# EasyEDA schematic oLoRa-part-power.json
TITLE: oLoRa-part-power; REV: 1.0; Date: 2019-08-19; Sheet: 1/1; Drawn By: 김석현; Company: RMTEC
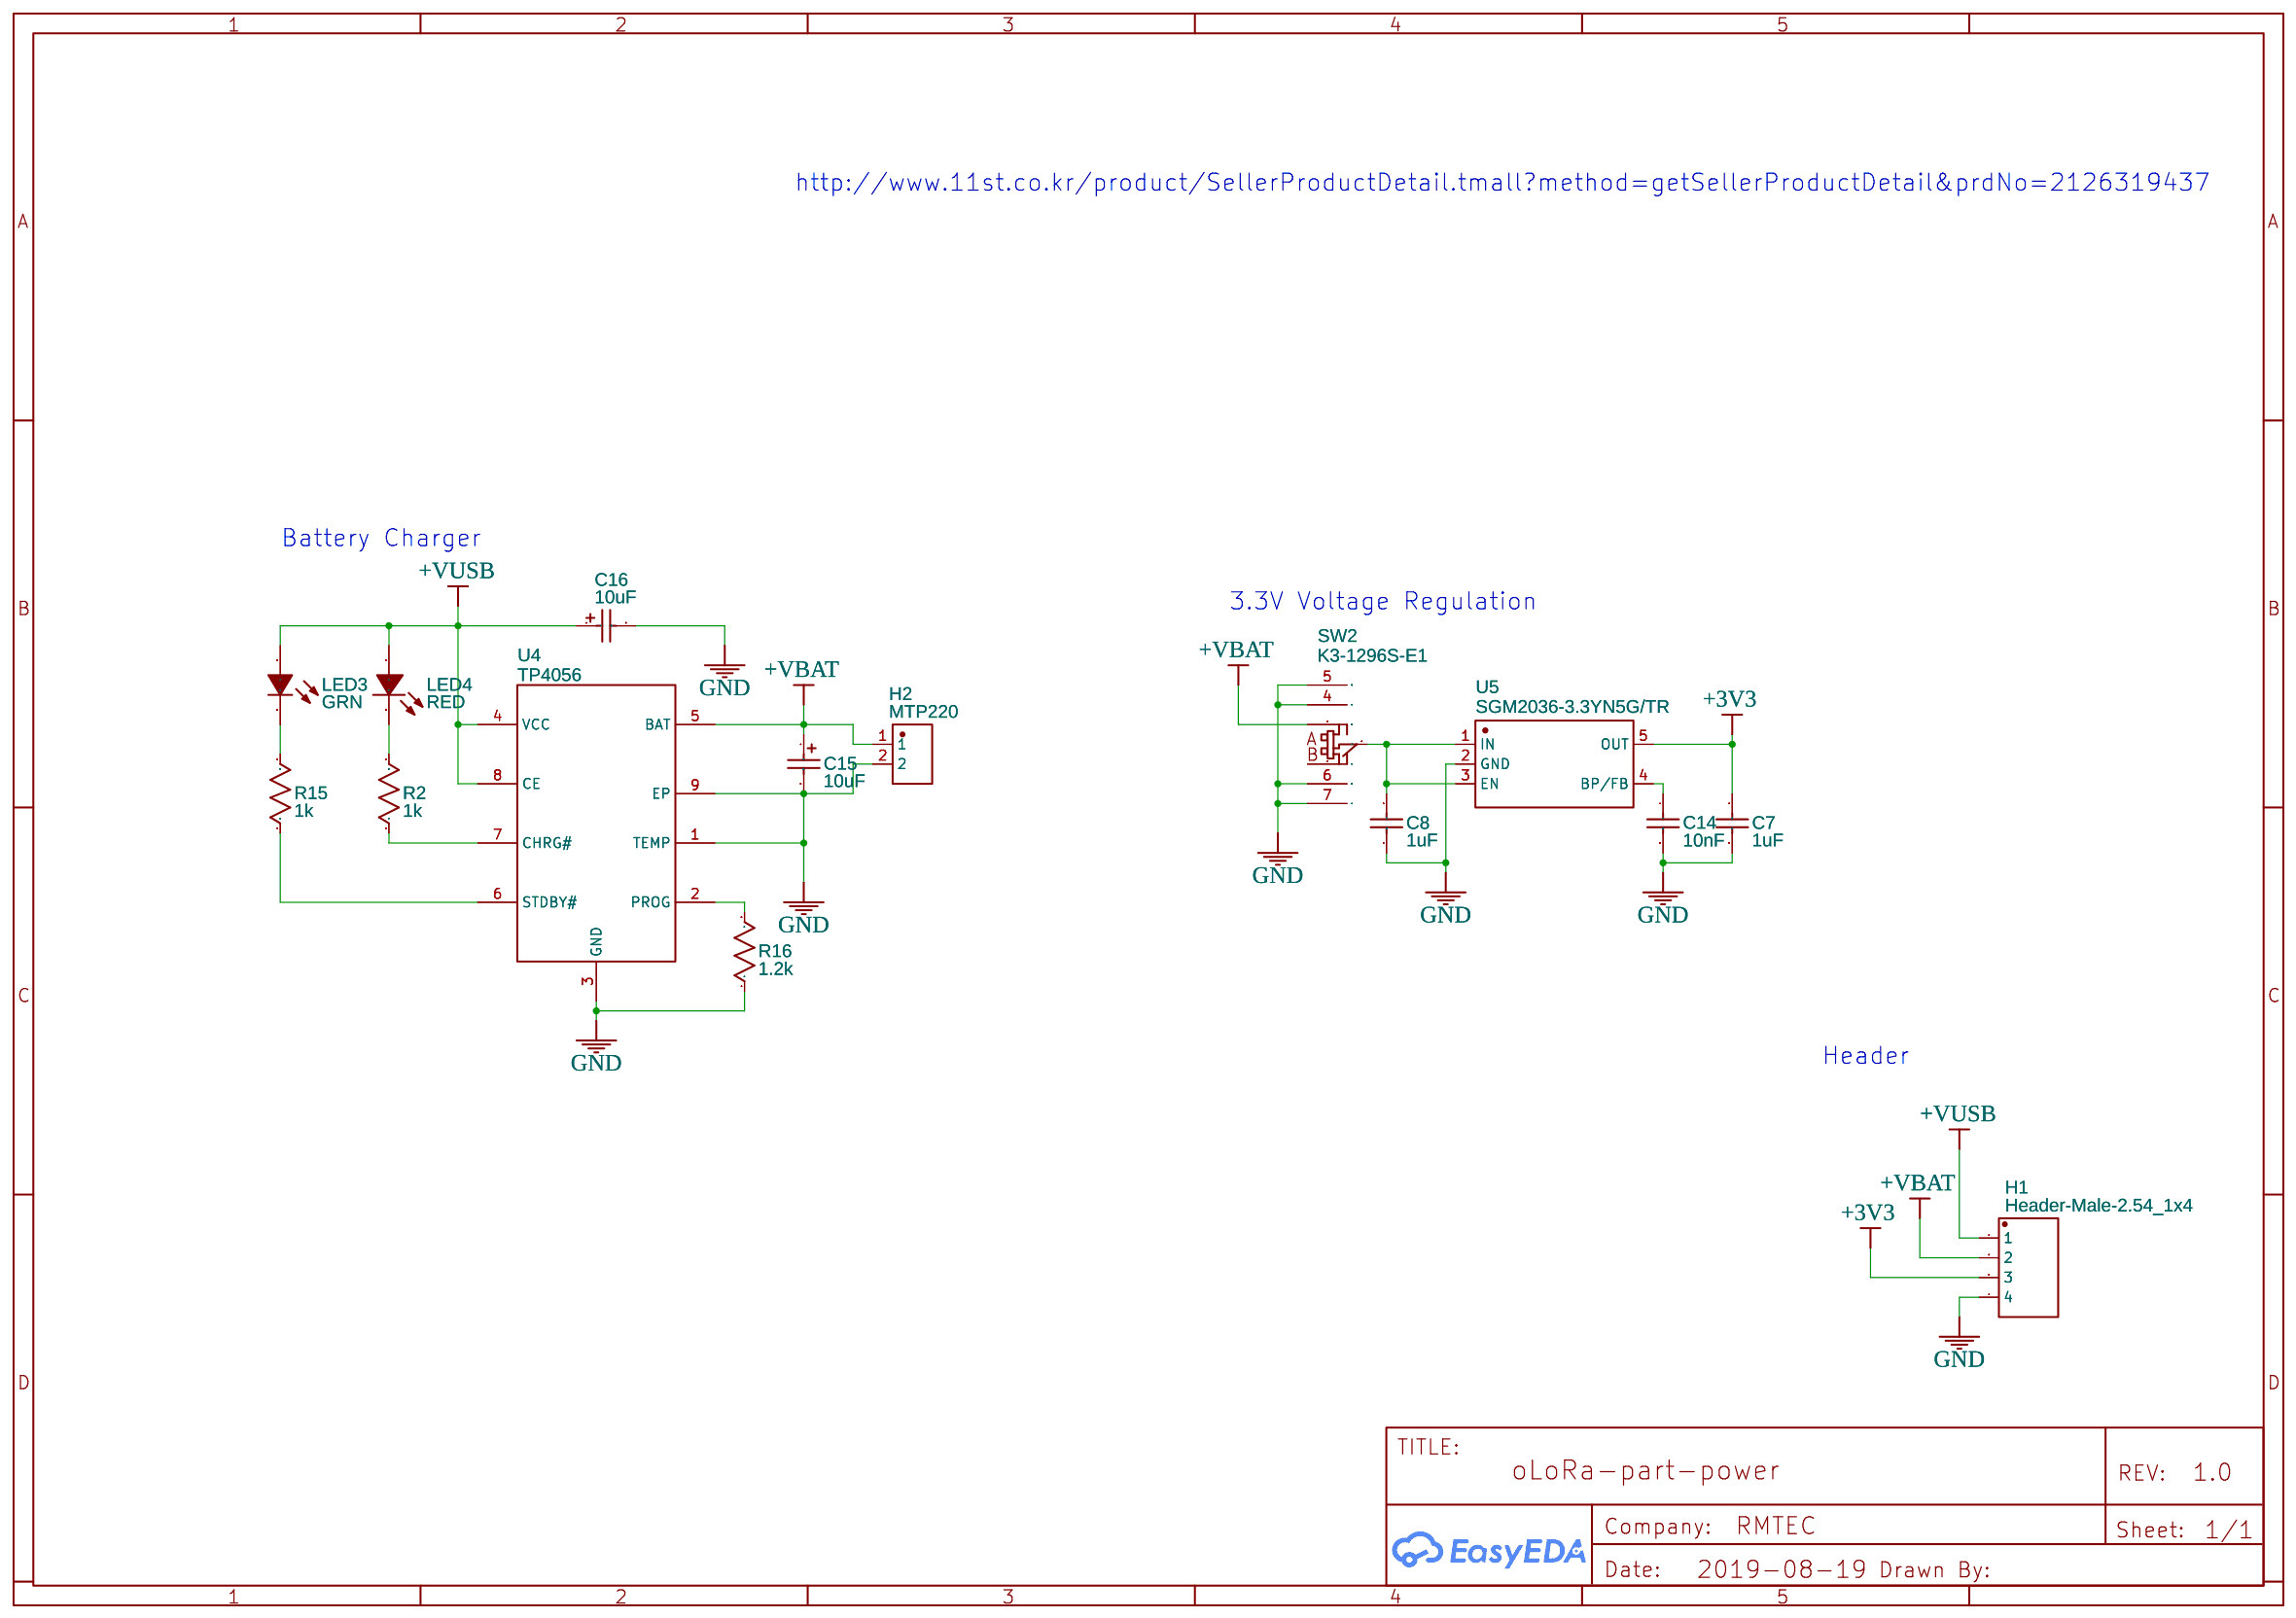
[diagram p0: schematic sheet]

## Parts
C7  1uF  [0603]
C8  1uF  [0603]
C14  10nF  [0603]
C15  10uF  [CAP-CASE-A_3216]
C16  10uF  [CAP-CASE-A_3216]
H1  Header-Male-2.54_1x4  [210S-1X4P]
H2  MTP220  [PH-TH_2PIN-H-MALE-PITCH2.00-L]
LED3  GRN  [LED-0603]
LED4  RED  [LED-0603]
R2  1k  [0603]
R15  1k  [0603]
R16  1.2k  [0603]
SW2  K3-1296S-E1  [K3-1296S-E1]
U4  TP4056  [SOP-8_EP_150MIL]
U5  SGM2036-3.3YN5G/TR  [SOT-23-5]

## Library data of the parts
C7 C8 = CL10B105KQ8NNNC: Supplier: LCSC; Manufacturer: SAMSUNG; Supplier Part: C105524
C14 = CGA3E2C0G1H103JT0Y0N: Supplier: LCSC; Supplier Part: C76710; Manufacturer: TDK; Contributor: LCSC; LCSC Assembly: Yes; SMT Type: Extend
C15 C16 = TAJA106K016RNJ: Supplier: LCSC; Manufacturer: AVX; LCSC Assembly: Yes; Supplier Part: C7171; SMT Type: Basic
H1 = -: Supplier: LCSC; Manufacturer: Ckmtw; Manufacturer Part: 210S-1*4P L=11.6MMGold-plated black; Contributor: LCSC; Supplier Part: C124378
H2 = -: Supplier: LCSC; Supplier Part: C376096; Manufacturer: MINTRON; Manufacturer Part: MTP220-1102R1; Contributor: LCSC
LED3 = -: Supplier: LCSC; Manufacturer: EVERLIGHT; Manufacturer Part: 19-217/GHC-YR1S2/3T; LCSC Assembly: Yes; image: //image.lceda.cn/szlcsc/C72043.jpg; Supplier Part: C72043; SMT Type: Basic
LED4 = -: Supplier: LCSC; Manufacturer: KENTO; Manufacturer Part: KT-0603R; LCSC Assembly: Yes; image: //image.lceda.cn/szlcsc/C2286.jpg; Supplier Part: C2286; SMT Type: Basic
R2 R15 R16 = Res_0603(1/10W)_US
SW2 = -: Supplier: LCSC; Manufacturer: HRO; Contributor: LCSC; Supplier Part: C128955
U4 = -: Contributor: Guest; Supplier: LCSC; Manufacturer: TOPPOWER; LCSC Assembly: Yes; image: //image.lceda.cn/szlcsc/C16581.jpg; Supplier Part: C16581; SMT Type: Basic
U5 = -: Supplier: LCSC; Manufacturer: SGMICRO; Supplier Part: C92402; LCSC Assembly: Yes; SMT Type: Extend

## Nets
+3V3: C7.2 H1.3 U5.5(OUT)
+VBAT: C15.1 H1.2 H2.1 SW2.3 U4.5(BAT)
GND: C7.1 C8.1 C14.2 C15.2 C16.2 H1.4 H2.2 R16.1 SW2.4 SW2.5 SW2.6 SW2.7 U4.1(TEMP) U4.3(GND) U4.9(EP) U5.2(GND)
+VUSB: C16.1 H1.1 LED3.1(A) LED4.1(A) U4.4(VCC) U4.8(CE)
Net-(C8-2): C8.2 SW2.2 U5.1(IN) U5.3(EN)
Net-(C14-1): C14.1 U5.4(BP/FB)
Net-(LED3-2): LED3.2(C) R15.2
Net-(LED4-2): LED4.2(K) R2.2
Net-(R2-1): R2.1 U4.7(CHRG#)
Net-(R15-1): R15.1 U4.6(STDBY#)
Net-(R16-2): R16.2 U4.2(PROG)

Not connected (* = marked no-connect by the designer): SW2 1

## Notes on the sheet
- http://www.11st.co.kr/product/SellerProductDetail.tmall?method=getSellerProductDetail&prdNo=2126319437
- Battery Charger
- 3.3V Voltage Regulation
- Header
